# Altium schematic sheet Microcontroller.SchDoc
size A4; SheetNumber: 1; SheetTotal: 1; SPICEModelCacheAGEHDMVT: <root> / <DocumentId>AGEHDMVT</DocumentId> / </root>
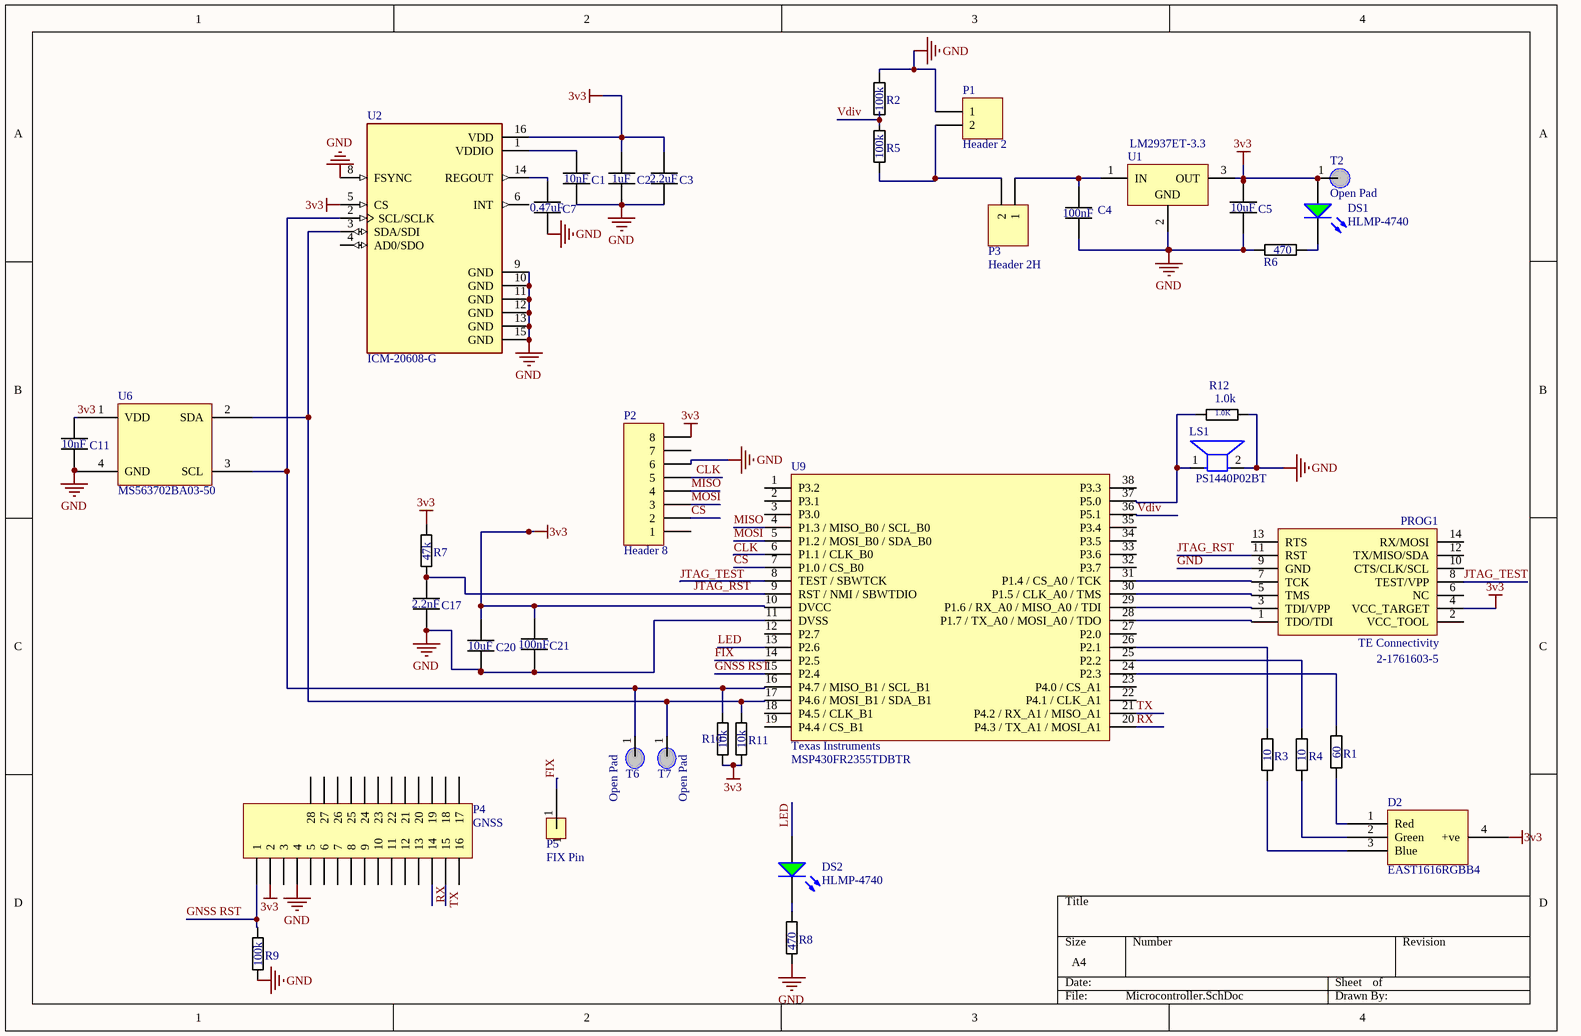
[diagram p0: Microcontroller.SchDoc]

## Parts
C1  value 10nF  [0603 (Capacitor)]  (hidden comment: C-n-010.000-5-0603)
C2  value 1uF  [0603 (Capacitor)]  (hidden comment: C-n-001.000-5-0603)
C3  value 2.2uF  [0603 (Capacitor)]  (hidden comment: C-n-001.000-5-0603)
C4  value 100nF  [0603 (Capacitor)]  (hidden comment: C-n-100.000-10-0603)
C5  value 10uF  [0603 (Capacitor)]  (hidden comment: C-n-100.000-10-0603)
C7  value 0.47uF  [0603 (Capacitor)]  (hidden comment: C-n-010.000-5-0603)
C11  value 10nF  [0603 (Capacitor)]  (hidden comment: C-n-010.000-5-0603)
C17  value 2.2nF  [0603 (Capacitor)]  (hidden comment: C-n-002.200-5-0603)
C20  value 10uF  [0603 (Capacitor)]  (hidden comment: C-n-001.000-5-0603)
C21  value 100nF  [0603 (Capacitor)]  (hidden comment: C-n-100.000-10-0603)
D2  EAST1616RGBB4  [EAST1616RGBB4 - duplicate1]
DS1  HLMP-4740  [AVAG-HLMP-4740]
DS2  HLMP-4740  [AVAG-HLMP-4740]
LS1  PS1440P02BT  [BUZZER_PS1440P02BT]
P1  Header 2  [Battery Connector- 620102131822]
P2  Header 8  [HDR1X8]
P3  Header 2H  [HDR1X2H]
P4  GNSS  [HDR2X16_CEN]
P5  FIX Pin  [Header 1 Pin]
PROG1  Manufacturer: TE Connectivity  Manufucturer PartNo: 2-1761603-5  [TE 2-1761603-5]  (hidden comment: MSP430 Programming Header)
R1  value 60  [0603 (Resistor)]  (hidden comment: R-k-010.000-1-0603)
R2  value 100k  [0603 (Resistor)]  (hidden comment: R-k-100.000-1-0603)
R3  value 10  [0603 (Resistor)]  (hidden comment: R-k-010.000-1-0603)
R4  value 10  [0603 (Resistor)]  (hidden comment: R-k-010.000-1-0603)
R5  value 100k  [0603 (Resistor)]  (hidden comment: R-k-100.000-1-0603)
R6  value 470  [0603 (Resistor)]  (hidden comment: R-k-001.500-1-0603)
R7  value 47k  [0603 (Resistor)]  (hidden comment: R-k-047.000-1-0603)
R8  value 470  [0603 (Resistor)]  (hidden comment: R-k-001.500-1-0603)
R9  value 100k  [0603 (Resistor)]  (hidden comment: R-k-100.000-1-0603)
R10  value 10k  [0603 (Resistor)]  (hidden comment: R-k-010.000-1-0603)
R11  value 10k  [0603 (Resistor)]  (hidden comment: R-k-010.000-1-0603)
R12  1.0k  [1.0k through hole]
T2  Open Pad  [Open Pad]
T6  Open Pad  [Open Pad]
T7  Open Pad  [Open Pad]
U1  LM2937ET-3.3  [NDE0003A]
U2  ICM-20608-G  [ICM-20608-G]
U6  MS563702BA03-50  [MS5837-30BA]
U9  Manufacturer: Texas Instruments  Manufacturer Part Number: MSP430FR2355TDBTR  [MSP430FR2355 38-TFSOP]  (hidden comment: MSP430FR2355 38-TFSOP)

## Nets
3v3: C2.1 C3.1 C5.1 C11.1 C20.1 C21.1 D2.4(+ve) DS1.1(A) P2.8 P4.2 PROG1.4(VCC_TARGET) R7.1 R10.2 R11.2 T2.1 U1.3(OUT) U2.5(CS) U2.16(VDD) U6.1(VDD) U9.10(DVCC)
GND: C1.2 C2.2 C3.2 C4.2 C5.2 C7.2 C11.2 C17.2 C20.2 C21.2 LS1.2 P1.1 P2.6 P4.4 PROG1.9(GND) R2.1 R6.1 R8.2 R9.2 R12.1 U1.2(GND) U2.8(FSYNC) U2.9(GND) U2.10(GND) U2.11(GND) U2.12(GND) U2.13(GND) U2.15(GND) U6.4(GND) U9.11(DVSS)
CLK: P2.5 U9.6(P1.1_/_CLK_B0)
CS: P2.2 U9.7(P1.0_/_CS_B0)
FIX: P5.1 U9.14(P2.5)
GNSS RST: P4.1 R9.1 U9.15(P2.4)
JTAG_RST: C17.1 PROG1.11(RST) R7.2 U9.9(RST_/_NMI_/_SBWTDIO)
JTAG_TEST: PROG1.8(TEST/VPP) U9.8(TEST_/_SBWTCK)
LED: DS2.1(A) U9.13(P2.6)
MISO: P2.4 U9.4(P1.3_/_MISO_B0_/_SCL_B0)
MOSI: P2.3 U9.5(P1.2_/_MOSI_B0_/_SDA_B0)
RX: P4.14 U9.20(P4.3_/_TX_A1_/_MOSI_A1)
TX: P4.15 U9.21(P4.2_/_RX_A1_/_MISO_A1)
Vdiv: R2.2 R5.1 U9.36(P5.1)
NetC1_1: C1.1 U2.1(VDDIO)
NetC4_1: C4.1 P3.1 U1.1(IN)
NetC7_1: C7.1 U2.14(REGOUT)
NetD2_1: D2.1(Red) R1.2
NetD2_2: D2.2(Green) R4.2
NetD2_3: D2.3(Blue) R3.2
NetDS1_2: DS1.2(K) R6.2
NetDS2_2: DS2.2(K) R8.1
NetLS1_1: LS1.1 R12.2 U9.37(P5.0)
NetP1_2: P1.2 P3.2 R5.2
NetPROG1_1: PROG1.1(TDO/TDI) U9.28(P1.7_/_TX_A0_/_MOSI_A0_/_TDO)
NetPROG1_3: PROG1.3(TDI/VPP) U9.29(P1.6_/_RX_A0_/_MISO_A0_/_TDI)
NetPROG1_5: PROG1.5(TMS) U9.30(P1.5_/_CLK_A0_/_TMS)
NetPROG1_7: PROG1.7(TCK) U9.31(P1.4_/_CS_A0_/_TCK)
NetR1_1: R1.1 U9.24(P2.3)
NetR3_1: R3.1 U9.26(P2.1)
NetR4_1: R4.1 U9.25(P2.2)
NetR10_1: R10.1 T6.1 U2.2(SCL/SCLK) U6.3(SCL) U9.16(P4.7_/_MISO_B1_/_SCL_B1)
NetR11_1: R11.1 T7.1 U2.3(SDA/SDI) U6.2(SDA) U9.17(P4.6_/_MOSI_B1_/_SDA_B1)

Not connected (* = marked no-connect by the designer): P2 1 7; P4 3 5 6 7 8 9 10 11 12 13 16 17(28) 18(27) 19(26) 20(25) 21(24) 22(23) 23(22) 24(21) 25(20) 26(19) 27(18) 28(17); PROG1 2(VCC_TOOL) 6(NC) 10(CTS/CLK/SCL) 12(TX/MISO/SDA) 13(RTS) 14(RX/MOSI); U2 4(AD0/SDO) 6(INT); U9 1(P3.2) 2(P3.1) 3(P3.0) 12(P2.7) 18(P4.5_/_CLK_B1) 19(P4.4_/_CS_B1) 22(P4.1_/_CLK_A1) 23(P4.0_/_CS_A1) 27(P2.0) 32(P3.7) 33(P3.6) 34(P3.5) 35(P3.4) 38(P3.3)

## Notes on the sheet
- (in symbol 1.0k through hole resistor) 1.0K

## Library data of the parts
C1 C11 = C-n-010.000-5-0603: Capacitor 10nF 0603 +/-5%; Manufacturer: Murata; Manufacturer PartNo: GRM1885C1H103JA01D; Case/Package: 0603; Tolerance: +/-5%
C2 = C-n-001.000-5-0603: Capacitor 1uF 0603 +/-5%; Manufacturer: Murata; Manufacturer PartNo: GCM1885C2A102JA16D; Case/Package: 0603; Tolerance: +/-5%
C3 = C-n-001.000-5-0603: Capacitor 2,2uF 0603 +/-5%; Manufacturer: Murata; Manufacturer PartNo: GCM1885C2A102JA16D; Case/Package: 0603; Tolerance: +/-5%
C4 C21 = C-n-100.000-10-0603: Capacitor 100nF 0603 +/-10%; Manufacturer: Murata; Manufacturer PartNo: GRM188R72A104KA35D; Case/Package: 0603; Tolerance: +/-10%
C5 = C-n-100.000-10-0603: Capacitor 10uF 0603 +/-10%; Manufacturer: Murata; Manufacturer PartNo: GRM188R72A104KA35D; Case/Package: 0603; Tolerance: +/-10%
C7 = C-n-010.000-5-0603: Capacitor 0.47uF 0603 +/-5%; Manufacturer: Murata; Manufacturer PartNo: GRM1885C1H103JA01D; Case/Package: 0603; Tolerance: +/-5%
C17 = C-n-001.000-5-0603: Capacitor 2.2nF 0603 +/-5%; Manufacturer: Murata; Manufacturer PartNo: GCM1885C2A102JA16D; Case/Package: 0603; Tolerance: +/-5%
C20 = C-n-001.000-5-0603: Capacitor 10uF 0603 +/-5%; Manufacturer: Murata; Manufacturer PartNo: GCM1885C2A102JA16D; Case/Package: 0603; Tolerance: +/-5%
DS1 DS2 = CMP-2000-06413-1: T-1 3/4 (5 mm) Low Current LED Lamp, Green, 1.9 V, -20 to 100 degC, 2-Pin THD, RoHS, Bulk; Manufacturer: AvagoTechnologies; Type: Uni-Color; Peak Wavelength: 565nm; Rad Hard: No; Viewing Angle: 50°; Dominant Wavelength/Color Temperature: 569nm; Number of LEDs: 1; Lens Appearance: ColoredDiffused; Lens Shape Type: Circular; Mounting Orientation: TopMount; Intensity: 2.3mcd; Datasheet Version: 07/2014; Category: LEDs; Datasheet URL: http://docs.avagotech.com/docs/AV02-1557EN; Packaging: Bulk; Pin Count: 2; Mounting Technology: ThroughHole; Package Reference: HLMP-4740; Mounting: ThroughHole; Manufacturer URL: http://www.avagotech.com/; Color: Green; Package: 2T-13/4; Package Description: 2-Pin Through Hole Device, Dia 5.845 mm, Pitch 2.54 mm
LS1 = PS1440P02BT: Buzzers Transducer, Externally Driven Piezo 3V 4kHz 75dB @ 3V, 10cm Through Hole PC Pins; MF: TDK; Digi-Key_Part_Number: 445-5242-1-ND; Package: SOP-8 TDK; MP: PS1440P02BT; Digi-Key_Purchase_URL: https://www.digikey.com/product-detail/en/tdk-corporation/PS1440P02BT/445-5242-1-ND/2236832?utm_source=snapeda&utm_medium=aggregator&utm_campaign=symbol; SnapEDA_Link: https://www.snapeda.com/parts/PS1440P02BT/TDK/view-part/295705/?ref=snap; Value: *
P1 = Header 2: Header, 2-Pin; LatestRevisionDate: 17-Jul-2002; LatestRevisionNote: Re-released for DXP Platform.; Publisher: Altium Limited
P2 = Header 8: Header, 8-Pin; LatestRevisionDate: 17-Jul-2002; LatestRevisionNote: Re-released for DXP Platform.; Publisher: Altium Limited
P3 = Header 2H: Header, 2-Pin, Right Angle; LatestRevisionDate: 17-Jul-2002; LatestRevisionNote: Re-released for DXP Platform.; Publisher: Altium Limited
P4 = Header 16X2A: Header, 16-Pin, Dual row; LatestRevisionDate: 17-Jul-2002; LatestRevisionNote: Re-released for DXP Platform.; Publisher: Altium Limited
P5 = Head 1-pin
PROG1 = MSP430 Programming Header: 14 Pin JTAG Header for MSP430 Debug Probe
R1 = R-k-010.000-1-0603: Resistor 60 0603 +/-1%; Manufacturer: Vishay Dale; Manufacturer PartNo: CRCW060310K0FKEAHP; Tolerance: +/-1%; Case/Package: 0603
R2 R5 R9 = R-k-100.000-1-0603: Resistor 100k 0603 +/-1%; Manufacturer: Vishay Dale; Manufacturer PartNo: CRCW0603100KFKEAHP; Tolerance: +/-1%; Case/Package: 0603
R3 R4 = R-k-010.000-1-0603: Resistor 10 0603 +/-1%; Manufacturer: Vishay Dale; Manufacturer PartNo: CRCW060310K0FKEAHP; Tolerance: +/-1%; Case/Package: 0603
R6 R8 = R-k-001.500-1-0603: Resistor 1.5k 0603 +/-1%; Manufacturer: Vishay Dale; Manufacturer PartNo: CRCW06031K50FKEAHP; Tolerance: +/-1%; Case/Package: 0603
R7 = R-k-068.000-1-0603: Resistor 47k 0603 +/-1%; Manufacturer: Vishay Dale; Manufacturer PartNo: CRCW060368K0FKEAHP; Tolerance: +/-1%; Case/Package: 0603
R10 R11 = R-k-010.000-1-0603: Resistor 10k 0603 +/-1%; Manufacturer: Vishay Dale; Manufacturer PartNo: CRCW060310K0FKEAHP; Tolerance: +/-1%; Case/Package: 0603
R12 = 1.0k through hole resistor
U1 = CMP-0062-02522-3: 500 mA Low Dropout Regulator, 3-pin TO-220; Manufacturer: Texas Instruments; PackageTopMarking: NSUZXYTTE#*LM2937ET*-3.3; PowerWise: N; CompType: LDO IC; ComponentLink1Description: Datasheet URL; PackageReference: NDE0003A; PackageDescription: TO-220, Molded, 3 Lead, Straight; PinCount: 3; ComponentLink1URL: http://www.ti.com/general/docs/lit/getliterature.tsp?genericPartNumber=LM2937-3.3&fileType=pdf; RoHS: N
U2 = ICM-20608-G: Accelerometer, Gyroscope, 6 Axis Sensor IÂ²C, SPI Output; MF: TDK InvenSense; Package: LGA-16 InvenSense; Purchase-URL: https://pricing.snapeda.com/search/part/ICM-20608-G/?ref=eda; Value: *; Price: None; Availability: Good; MP: ICM-20608-G; SnapEDA_Link: https://www.snapeda.com/parts/ICM-20608-G/TDK%20InvenSense/view-part/196551/?ref=snap
U6 = MS5837-02BA21: Pressure Sensor, Absolute, 2Bar, I2C; Manufacturer: TE Connectivity; Operating Pressure: 17.4PSI; Port Style: No Port; Max Pressure: 145.04PSI; Supplier 1: Digi-Key; Manufacturer Part Number: MS5837-02BA21; RoHS: No; Stock 1: 5173; Pricing 1: 1=12.98000, 5=11.38800, 10=10.24900, 25=9.11040, 50=8.42700, 100=7.28820, 500=6.83264, 1000=6.37714 (USD); Case/Package: SMD/SMT; Min Operating Temperature: -20°C; Max Operating Temperature: 85°C; Output Type: I2C; Pressure Type: Absolute; Termination: SMD/SMT; RoHS Compliant: Yes; ComponentLink1URL: https://www.te.com/commerce/DocumentDelivery/DDEController?Action=srchrtrv&amp;DocNm=MS5837-02BA01&amp;DocType=DS&amp;DocLang=English&src-supplier=Digi-Key; ComponentLink1Description: https://www.te.com/commerce/DocumentDelivery/DDEController?Action=srchrtrv&amp;DocNm=MS5837-02BA01&amp;DocType=DS&amp;DocLang=English&src-supplier=Digi-Key
U9 = MSP430FR2355 38-TFSOP: MSP430 Microcontroller